# Altium project SprinklerBoard.PrjPCB
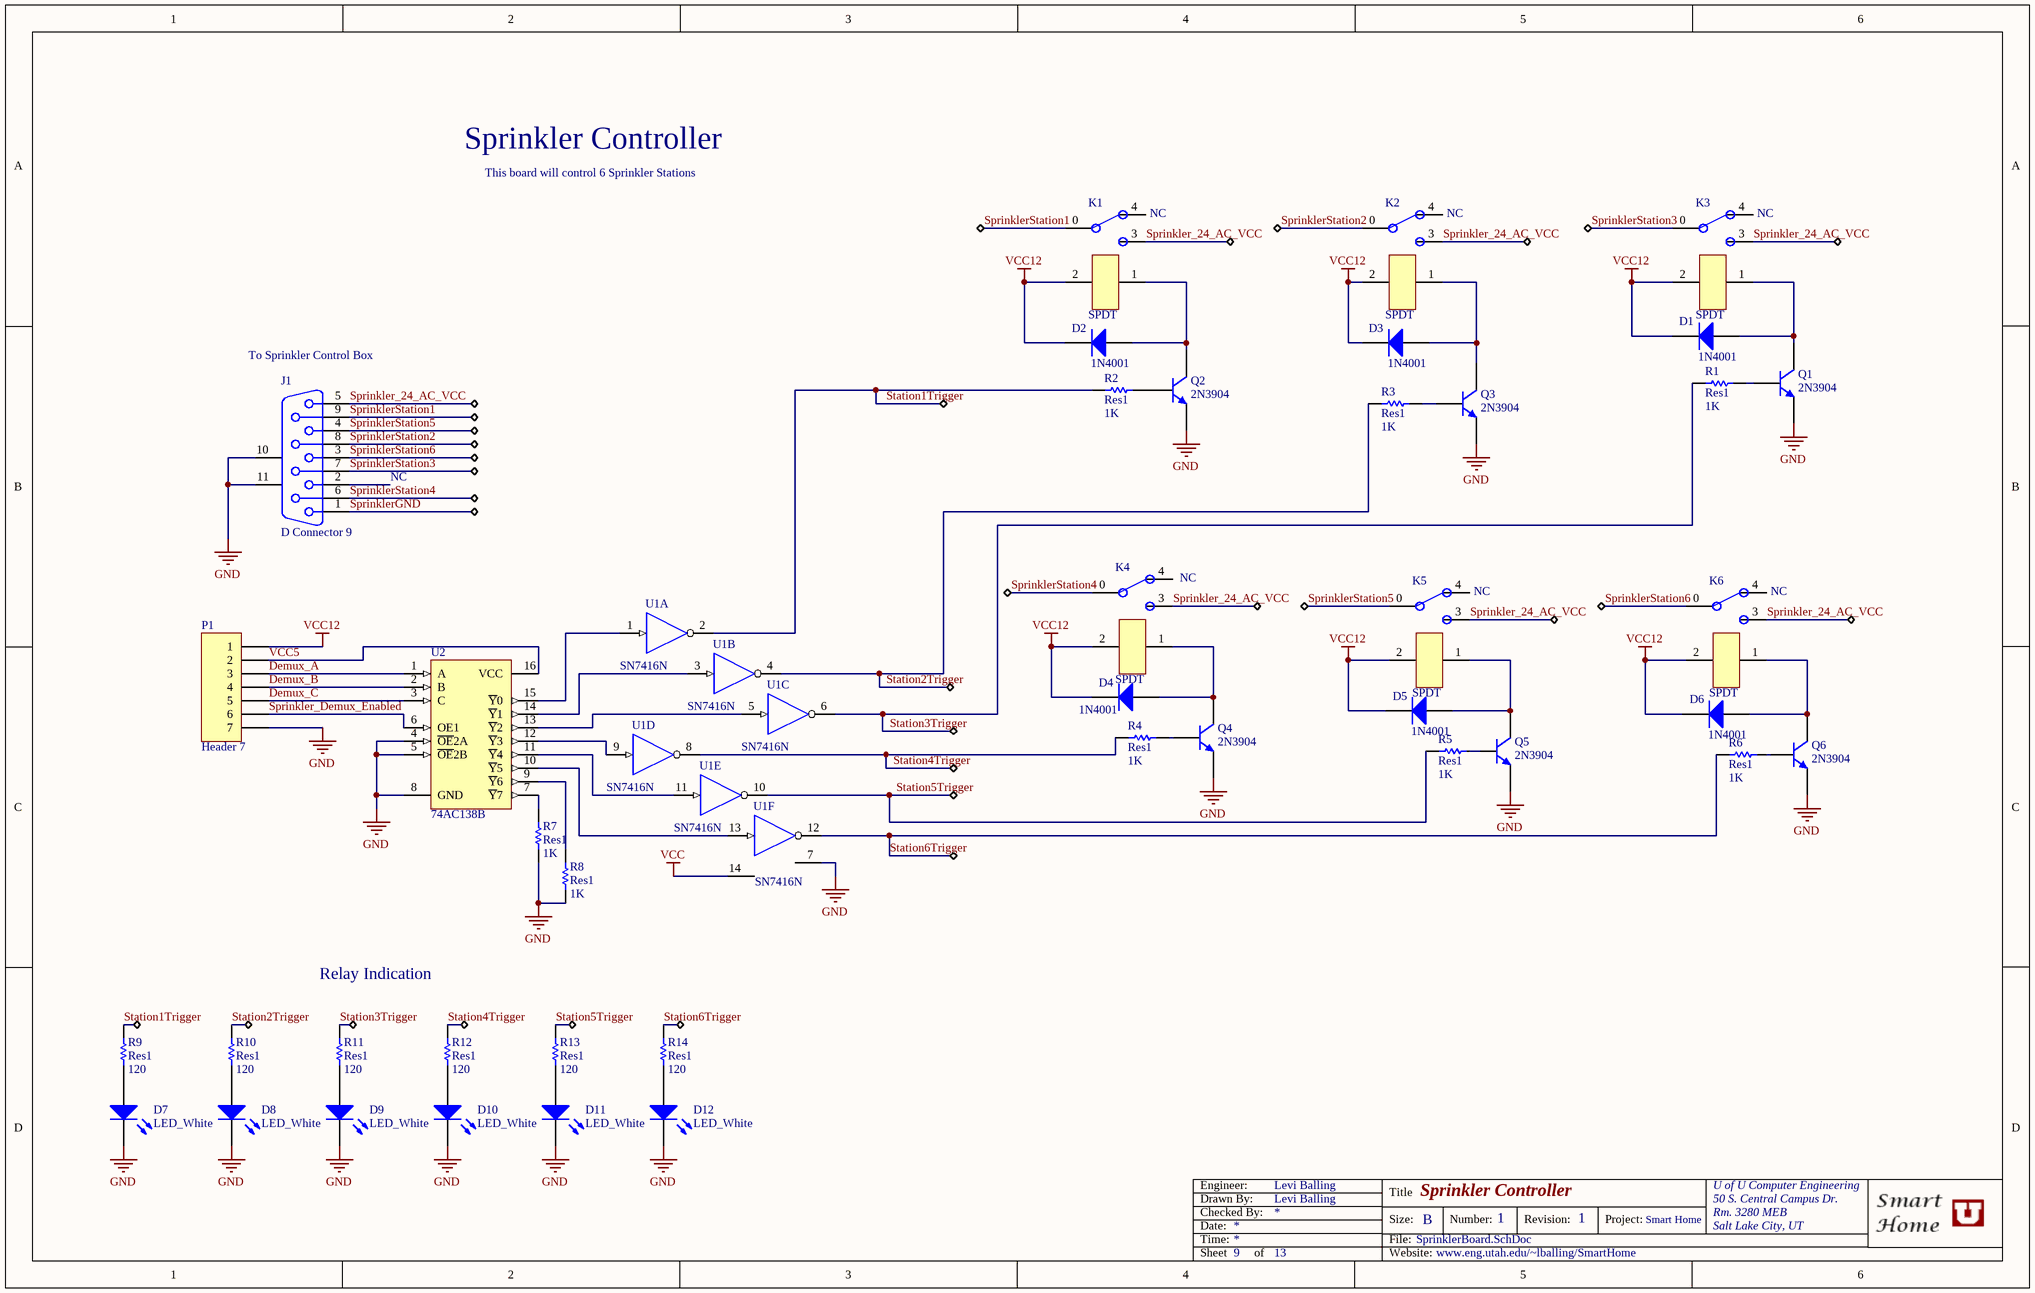
[diagram p0: SprinklerBoard.SchDoc]
1 sheet, 42 parts. Net scope: global (net labels, ports and power ports of the same name join across sheets).
Board file: SprinklerBoard.PcbDoc

## Sheet SprinklerBoard.SchDoc: Sprinkler Controller
size B; DrawnBy: Levi Balling; Engineer: Levi Balling; Organization: U of U Computer Engineering; Address1: 50 S. Central Campus Dr.; Address2: Rm. 3280 MEB; Address3: Salt Lake City, UT; Address4: Australia 2086; DocumentNumber: 1; Revision: 1; SheetNumber: 9; SheetTotal: 13; Website: www.eng.utah.edu/~lballing/SmartHome; Project: Smart Home; Description: This board will control 6 Sprinkler Stations; ProjectName: Smart Home

### Parts
D1  1N4001  [DO-41]
D2  1N4001  [DO-41]
D3  1N4001  [DO-41]
D4  1N4001  [DO-41]
D5  1N4001  [DO-41]
D6  1N4001  [DO-41]
D7  LED_White  [LED]
D8  LED_White  [LED]
D9  LED_White  [LED]
D10  LED_White  [LED]
D11  LED_White  [LED]
D12  LED_White  [LED]
J1  D Connector 9  [DSUB1.385-2H9]
K1  SPDT  [Relay  SPDT Tayda]
K2  SPDT  [Relay  SPDT Tayda]
K3  SPDT  [Relay  SPDT Tayda]
K4  SPDT  [Relay  SPDT Tayda]
K5  SPDT  [Relay  SPDT Tayda]
K6  SPDT  [Relay  SPDT Tayda]
P1  Header 7  [HDR1X7]
Q1  2N3904  [2N3904]
Q2  2N3904  [2N3904]
Q3  2N3904  [2N3904]
Q4  2N3904  [2N3904]
Q5  2N3904  [2N3904]
Q6  2N3904  [2N3904]
R1  Res1  value 1K  [AXIAL-0.3]
R2  Res1  value 1K  [AXIAL-0.3]
R3  Res1  value 1K  [AXIAL-0.3]
R4  Res1  value 1K  [AXIAL-0.3]
R5  Res1  value 1K  [AXIAL-0.3]
R6  Res1  value 1K  [AXIAL-0.3]
R7  Res1  value 1K  [AXIAL-0.3]
R8  Res1  value 1K  [AXIAL-0.3]
R9  Res1  value 120  [AXIAL-0.3]
R10  Res1  value 120  [AXIAL-0.3]
R11  Res1  value 120  [AXIAL-0.3]
R12  Res1  value 120  [AXIAL-0.3]
R13  Res1  value 120  [AXIAL-0.3]
R14  Res1  value 120  [AXIAL-0.3]
U1  SN7416N  [N014]  (parts A,B,C,D,E,F of 6)
U2  74AC138B  [DIP16]

### Nets
GND: D7.2(K) D8.2(K) D9.2(K) D10.2(K) D11.2(K) D12.2(K) J1.10(MH1) J1.11(MH2) P1.7 Q1.1(E) Q2.1(E) Q3.1(E) Q4.1(E) Q5.1(E) Q6.1(E) R7.1 R8.1 U1.7(GND) U2.4(~{OE}2A) U2.5(~{OE}2B) U2.8(GND)
VCC: U1.14(VCC)
VCC12: D1.2(K) D2.2(K) D3.2(K) D4.2(K) D5.2(K) D6.2(K) K1.2 K2.2 K3.2 K4.2 K5.2 K6.2 P1.1
Demux_A: P1.3 U2.1(A)
Demux_B: P1.4 U2.2(B)
Demux_C: P1.5 U2.3(C)
Sprinkler_24_AC_VCC: J1.5 K1.3 K2.3 K3.3 K4.3 K5.3 K6.3
Sprinkler_Demux_Enabled: P1.6 U2.6(OE1)
SprinklerGND: J1.1
SprinklerStation1: J1.9 K1.0
SprinklerStation2: J1.8 K2.0
SprinklerStation3: J1.7 K3.0
SprinklerStation4: J1.6 K4.0
SprinklerStation5: J1.4 K5.0
SprinklerStation6: J1.3 K6.0
Station1Trigger: R2.2 R9.1 U1.2(Y)
Station2Trigger: R3.2 R10.1 U1.4(Y)
Station3Trigger: R1.2 R11.1 U1.6(Y)
Station4Trigger: R4.2 R12.1 U1.8(Y)
Station5Trigger: R5.2 R13.1 U1.10(Y)
Station6Trigger: R6.2 R14.1 U1.12(Y)
VCC5: P1.2 U2.16(VCC)
NetD1_1: D1.1(A) K3.1 Q1.3(C)
NetD2_1: D2.1(A) K1.1 Q2.3(C)
NetD3_1: D3.1(A) K2.1 Q3.3(C)
NetD4_1: D4.1(A) K4.1 Q4.3(C)
NetD5_1: D5.1(A) K5.1 Q5.3(C)
NetD6_1: D6.1(A) K6.1 Q6.3(C)
NetD7_1: D7.1(A) R9.2
NetD8_1: D8.1(A) R10.2
NetD9_1: D9.1(A) R11.2
NetD10_1: D10.1(A) R12.2
NetD11_1: D11.1(A) R13.2
NetD12_1: D12.1(A) R14.2
NetQ1_2: Q1.2(B) R1.1
NetQ2_2: Q2.2(B) R2.1
NetQ3_2: Q3.2(B) R3.1
NetQ4_2: Q4.2(B) R4.1
NetQ5_2: Q5.2(B) R5.1
NetQ6_2: Q6.2(B) R6.1
NetR7_2: R7.2 U2.7(~{Y}7)
NetR8_2: R8.2 U2.9(~{Y}6)
NetU1_1: U1.1(A) U2.15(~{Y}0)
NetU1_3: U1.3(A) U2.14(~{Y}1)
NetU1_5: U1.5(A) U2.13(~{Y}2)
NetU1_9: U1.9(A) U2.12(~{Y}3)
NetU1_11: U1.11(A) U2.11(~{Y}4)
NetU1_13: U1.13(A) U2.10(~{Y}5)

Not connected (* = marked no-connect by the designer): J1 2; K1 4; K2 4; K3 4; K4 4; K5 4; K6 4

### Notes on the sheet
- (near K1) NC
- (near K2) NC
- (near K3) NC
- (near J1) To Sprinkler Control Box
- NC
- (near K4) NC
- (near K5) NC
- (near K6) NC
- Relay Indication
- Date:
- Time:
- Engineer:
- Drawn By:
- Checked By:
- Title
- Size:
- File:
- B
- Number:
- Revision:
- Project:
- Sheet
- of
- Website:

### Library data of the parts
D1-D6 = 1N4001: 1.0 Ampere General Purpose Rectifier; Vendor: Taydaelectronics; Published: 8-Jun-2000; LatestRevisionDate: 17-Jul-2002; LatestRevisionNote: Re-released for DXP Platform.; DatasheetDocument: 1998; PackageDocument: Aug-1999; PackageReference: DO-41; Publisher: Altium Limited; Code_JEDEC: DO-204-AL; ComponentLink1Description: Manufacturer Link; ComponentLink1URL: http://www.fairchildsemi.com/; ComponentLink2Description: Pinout Specification; ComponentLink2URL: http://www.fairchildsemi.com/ds/1N%2F1N4001.pdf; Price: 0.01; Value: 1N4001
D7-D12 = LED0: Typical INFRARED GaAs LED; Vendor: Taydaelectronics; Value: LED0; Published: 8-Jun-2000; LatestRevisionDate: 08-Jul-2005; LatestRevisionNote: Mech Layer 1 removed.; PackageReference: LED-0; Publisher: Altium Limited; PackageDescription: LED; 2 Leads; Price: 0.04
J1 = D Connector 9: Receptacle Assembly, 9 Position, Right Angle; PackageDocument: O; Positions: 9; Vendor: Taydaelectronics; Published: 15-Jun-2001; LatestRevisionDate: 17-Jul-2002; LatestRevisionNote: Re-released for DXP Platform.; DatasheetDocument: 1-Sep-1999; PackageReference: 788750; Publisher: Altium Limited; Orientation: Right Angle; Gender: Receptacle; Price: 0.48; Value: D Connector 9
K1-K6 = SPDT: Vendor: Taydaelectronics; Price: 0.64; Value: SPDT
P1 = Header 7: Header, 7-Pin; Vendor: Taydaelectronics; LatestRevisionDate: 17-Jul-2002; LatestRevisionNote: Re-released for DXP Platform.; Publisher: Altium Limited; Price: 0.07; Value: Header 7
Q1-Q6 = 2N3904: NPN General Purpose Amplifier; Vendor: Taydaelectronics; Published: 8-Jun-2000; LatestRevisionDate: 15-Jan-2003; LatestRevisionNote: PCB Footprint 'BCY-W3/D4.7' replaced; DatasheetVersion: 1997; PackageVersion: Sep-1998; PackageReference: TO-92A; Publisher: Altium Limited; PackageDescription: TO, Flat Index; 3 In-Line, Axial Leads; Body Dia. 4.5mm; Leads 0.51 x 0.48 mm (max); ComponentLink1URL: http://www.fairchildsemi.com/; ComponentLink2Description: Datasheet; ComponentLink2URL: http://www.fairchildsemi.com/ds/2N%2F2N3904.pdf; Price: 0.01; Value: 2N3904
R1-R14 = Res1: Resistor; Vendor: Taydaelectronics; Published: 8-Jun-2000; LatestRevisionDate: 17-Jul-2002; LatestRevisionNote: Re-released for DXP Platform.; PackageReference: AXIAL-0.3; Publisher: Altium Limited; PackageDescription: Axial Device, Thru-Hole; 2 Leads; 0.3 in Pin Spacing; Price: 0.01
U1 = SN7416N: Hex Inverter Buffer / Driver with High-Voltage Outputs; Vendor: Taydaelectronics; Published: 8-Jun-2000; LatestRevisionDate: 04-Mar-2005; LatestRevisionNote: Stylized 3D Model Added.; DatasheetVersion: Mar-1988; PackageVersion: Oct-1995; PackageReference: N014; Publisher: Altium Limited; PackageDescription: DIP; 14 Leads; Row Spacing 7.62 mm; Pitch 2.54 mm; ComponentLink1URL: http://www.ti.com/; ComponentLink2Description: Datasheet; ComponentLink2URL: http://www-s.ti.com/sc/ds/sn5416.pdf; ComponentLink3Description: Packaging Specification; ComponentLink3URL: http://focus.ti.com/lit/ml/mpdi002c/mpdi002c.pdf; Price: 0.18; Value: SN7416N
U2 = 74AC138B: 3-to-8 Line Decoder Inverting; Vendor: Taydaelectronics; Published: 8-Jun-2000; LatestRevisionDate: 06-Jun-2005; LatestRevisionNote: Stylized 3D Model Added.; DatasheetVersion: Apr-1997; PackageVersion: Apr-1996; PackageReference: DIP16; Publisher: Altium Limited; PackageDescription: DIP; 16 Leads; Row Spacing 7.62 mm; Pitch 2.54 mm; ComponentLink1URL: http://www.st.com/; ComponentLink2Description: Datasheet; ComponentLink2URL: http://www.st.com/stonline/products/literature/ds/4696/74ac138.pdf; Price: 0.25; Value: 74AC138B